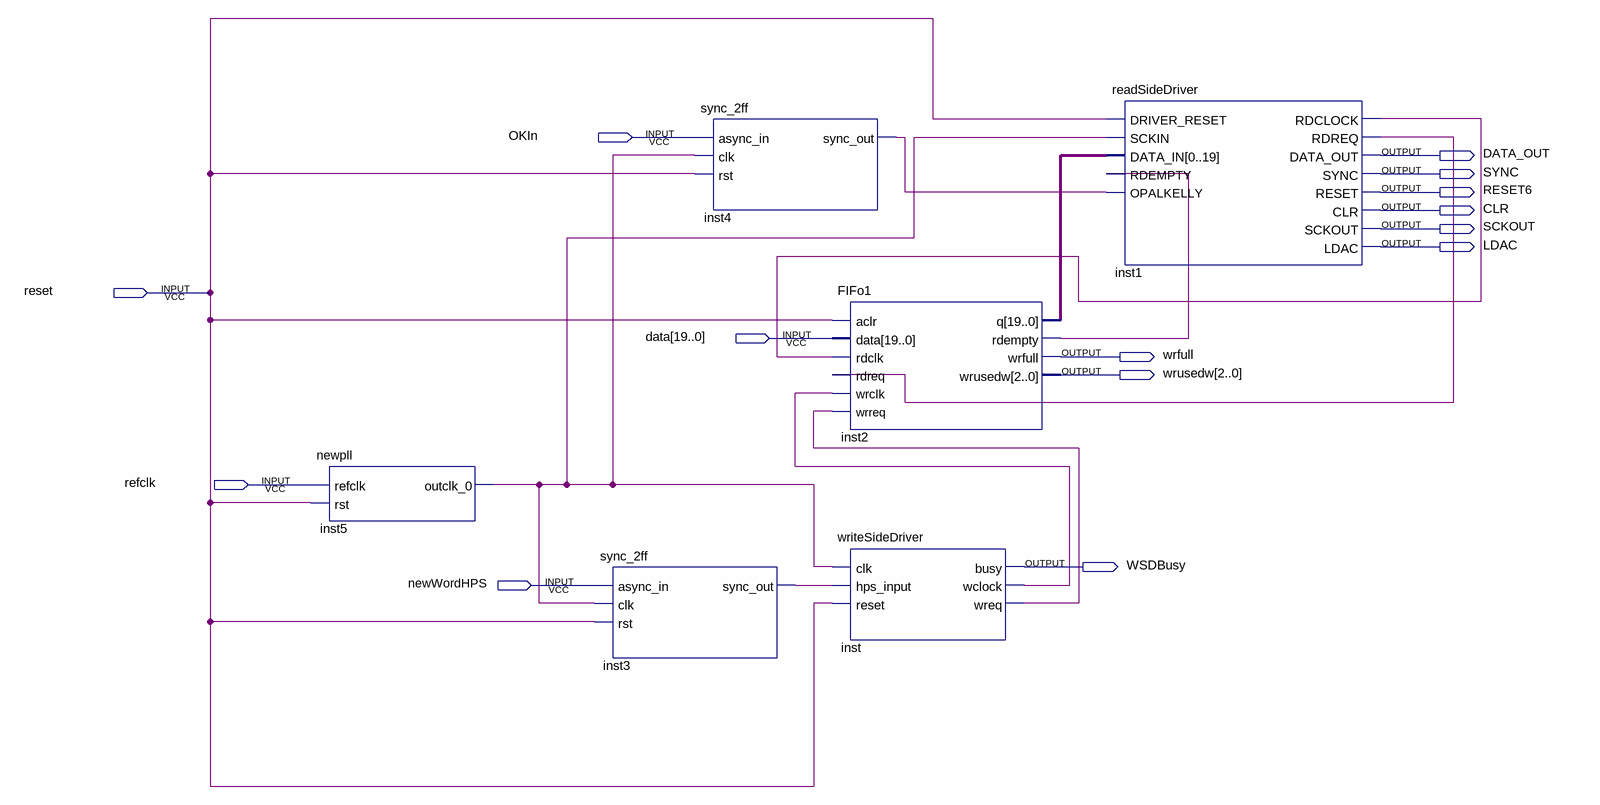
[diagram p0: schematic sheet]
// Quartus schematic Sim1.bdf as structural Verilog: 6 symbols, 14 pins
module Sim1 (
  input  OKIn,
  input  reset,
  input  [19:0] data,
  input  refclk,
  input  newWordHPS,
  output DATA_OUT,
  output SYNC,
  output RESET6,
  output CLR,
  output SCKOUT,
  output LDAC,
  output wrfull,
  output [2:0] wrusedw,
  output WSDBusy
);

  wire inst1_rdclock, inst1_rdreq, inst2_rdempty, inst3_sync_out, inst4_sync_out, inst5_outclk_0,
       inst_wclock, inst_wreq;
  wire [19:0] inst2_q;

  newpll inst5 (.refclk(refclk), .rst(reset), .outclk_0(inst5_outclk_0));
  sync_2ff inst3 (.async_in(newWordHPS), .clk(inst5_outclk_0), .rst(reset), .sync_out(inst3_sync_out));
  sync_2ff inst4 (.async_in(OKIn), .clk(inst5_outclk_0), .rst(reset), .sync_out(inst4_sync_out));
  FIFo1 inst2 (
    .aclr(reset), .data(data), .rdclk(inst1_rdclock), .rdreq(inst1_rdreq), .wrclk(inst_wclock),
    .wrreq(inst_wreq), .q(inst2_q), .rdempty(inst2_rdempty), .wrfull(wrfull), .wrusedw(wrusedw));
  writeSideDriver inst (
    .clk(inst5_outclk_0), .hps_input(inst3_sync_out), .reset(reset), .busy(WSDBusy), .wclock(inst_wclock),
    .wreq(inst_wreq));
  readSideDriver inst1 (
    .DRIVER_RESET(reset), .SCKIN(inst5_outclk_0), .DATA_IN(inst2_q), .RDEMPTY(inst2_rdempty),
    .OPALKELLY(inst4_sync_out), .RDCLOCK(inst1_rdclock), .RDREQ(inst1_rdreq), .DATA_OUT(DATA_OUT),
    .SYNC(SYNC), .RESET(RESET6), .CLR(CLR), .SCKOUT(SCKOUT), .LDAC(LDAC));
endmodule
